# EasyEDA schematic EasyEDA_H-O-A_Switch_Plug.json
TITLE: MANOVR-V1; REV: 1.0; Date: 2025-10-01; Sheet: 1/1; Drawn By: DJL19229; Company: Day Controls
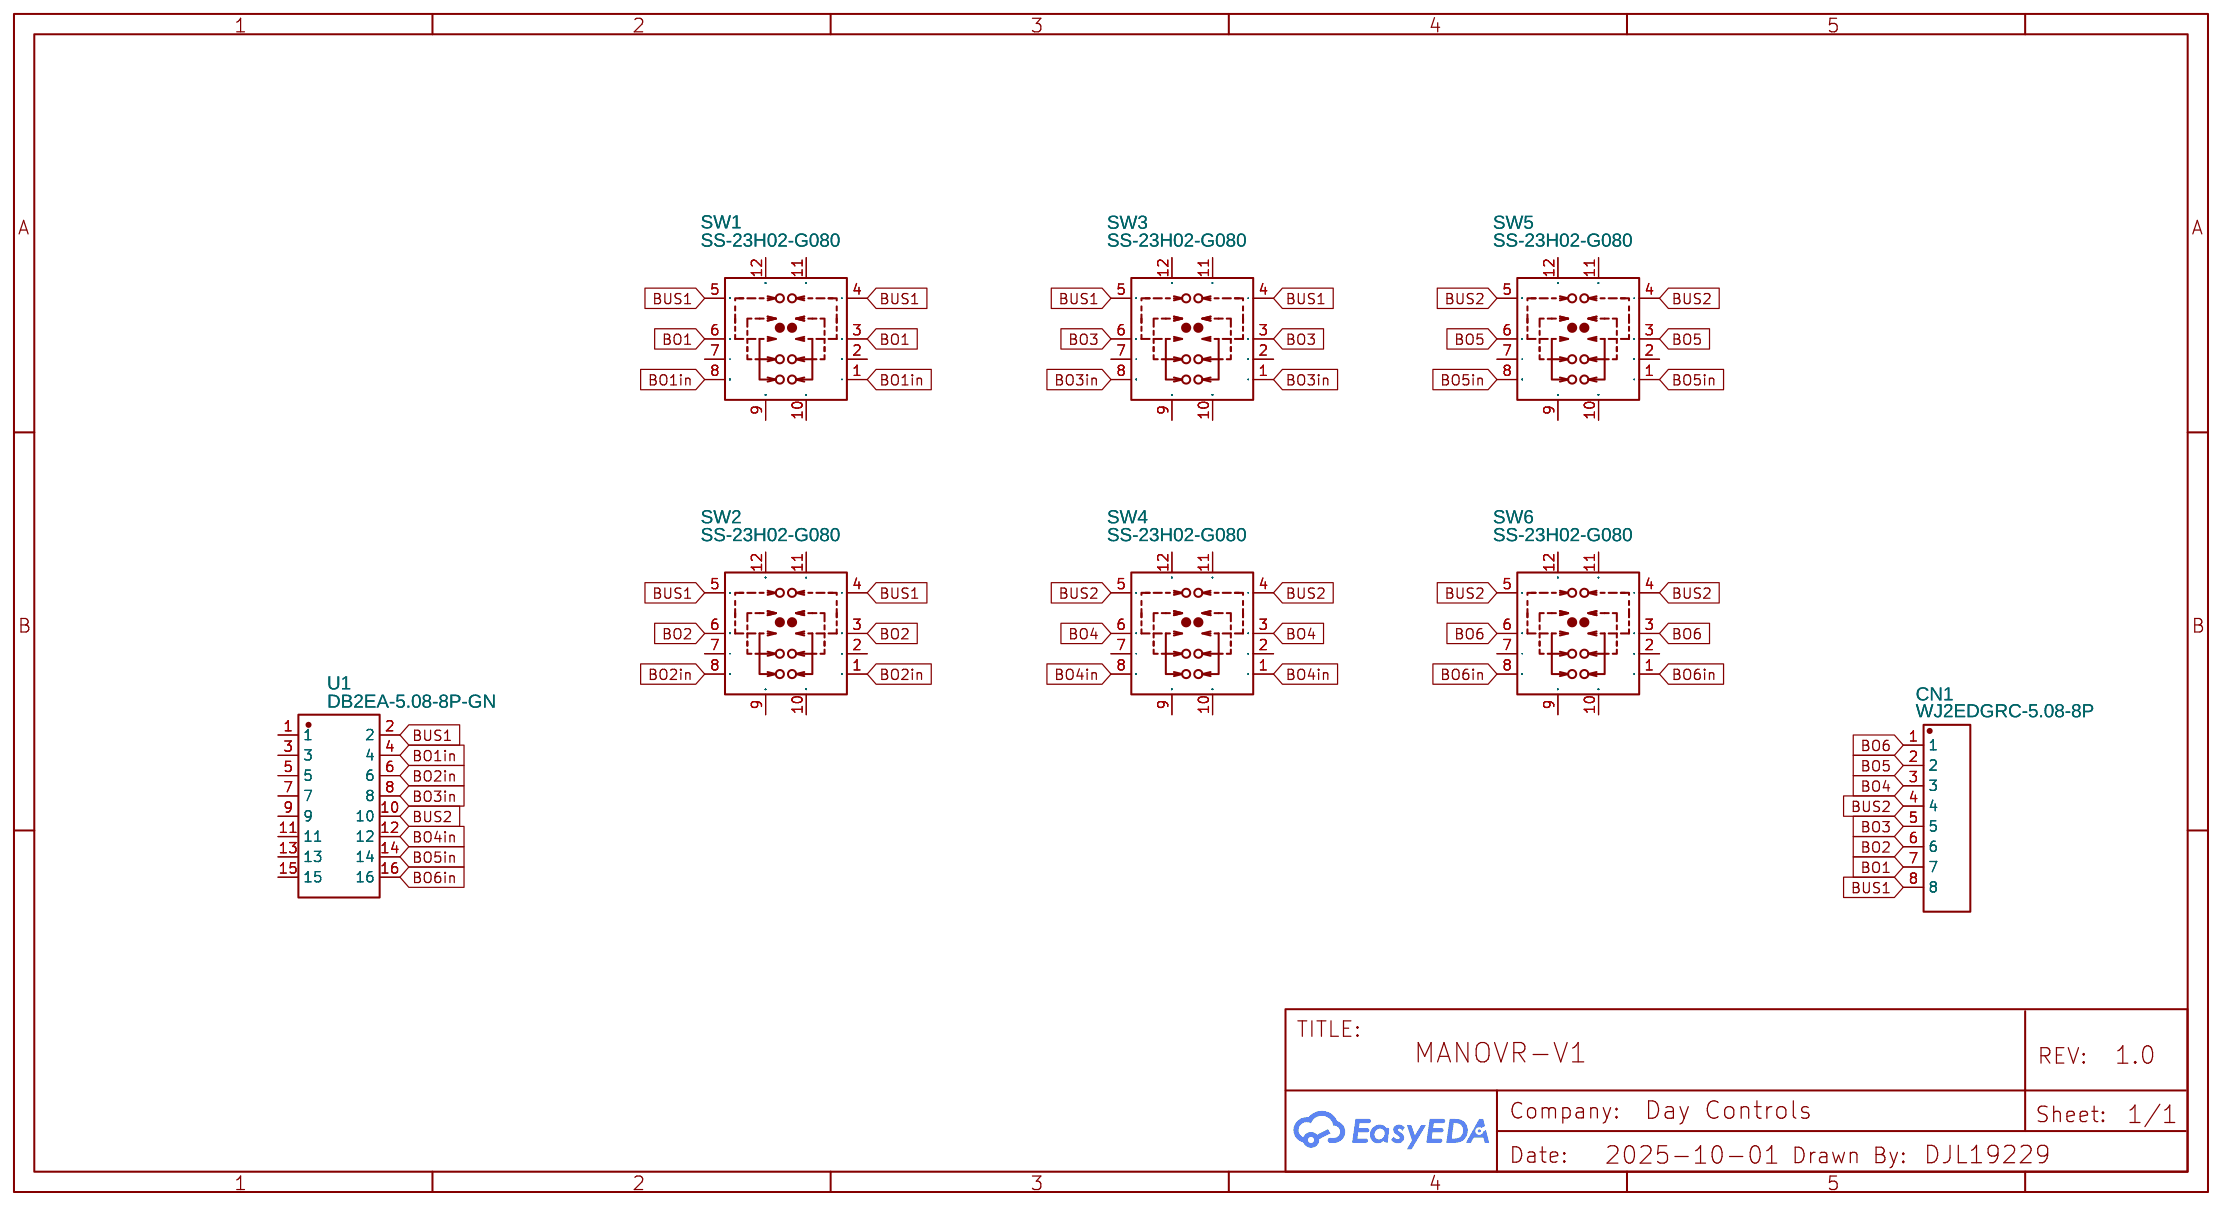
[diagram p0: schematic sheet]

## Parts
CN1  WJ2EDGRC-5.08-8P  [CONN-TH_8P-P5.08_WJ2EDGRC-5.08-8P]
SW1  SS-23H02-G080  [SW-TH_SS-23H02-GXXX]
SW2  SS-23H02-G080  [SW-TH_SS-23H02-GXXX]
SW3  SS-23H02-G080  [SW-TH_SS-23H02-GXXX]
SW4  SS-23H02-G080  [SW-TH_SS-23H02-GXXX]
SW5  SS-23H02-G080  [SW-TH_SS-23H02-GXXX]
SW6  SS-23H02-G080  [SW-TH_SS-23H02-GXXX]
U1  DB2EA-5.08-8P-GN  [CONN-TH_16P-P5.08_DIBO_DB2EA-5.08-8P-GN]

## Library data of the parts
CN1 = WJ2EDGRC-5.08-8P: Supplier: LCSC; Supplier Part: C27587; JLCPCB Part Class: Extended Part; Manufacturer: KANGNEX(康奈克斯电气)
SW1-SW6 = SS-23H02-G080: Contributor: LCSC; Supplier: LCSC; Supplier Part: C2876009; Manufacturer: G-Switch(品赞); JLCPCB Part Class: Extended Part
U1 = DB2EA-5.08-8P-GN: Supplier: LCSC; Supplier Part: C5189085; Manufacturer: DORABO(地博电气); JLCPCB Part Class: Extended Part; Contributor: lcsc

## Nets
BO1: CN1.7 SW1.3 SW1.6
BO1in: SW1.1 SW1.8 U1.4
BO2: CN1.6 SW2.3 SW2.6
BO2in: SW2.1 SW2.8 U1.6
BO3: CN1.5 SW3.3 SW3.6
BO3in: SW3.1 SW3.8 U1.8
BO4: CN1.3 SW4.3 SW4.6
BO4in: SW4.1 SW4.8 U1.12
BO5: CN1.2 SW5.3 SW5.6
BO5in: SW5.1 SW5.8 U1.14
BO6: CN1.1 SW6.3 SW6.6
BO6in: SW6.1 SW6.8 U1.16
BUS1: CN1.8 SW1.4 SW1.5 SW2.4 SW2.5 SW3.4 SW3.5 U1.2
BUS2: CN1.4 SW4.4 SW4.5 SW5.4 SW5.5 SW6.4 SW6.5 U1.10

Not connected (* = marked no-connect by the designer): SW1 2 7 9 10 11 12; SW2 2 7 9 10 11 12; SW3 2 7 9 10 11 12; SW4 2 7 9 10 11 12; SW5 2 7 9 10 11 12; SW6 2 7 9 10 11 12; U1 1 3 5 7 9 11 13 15
